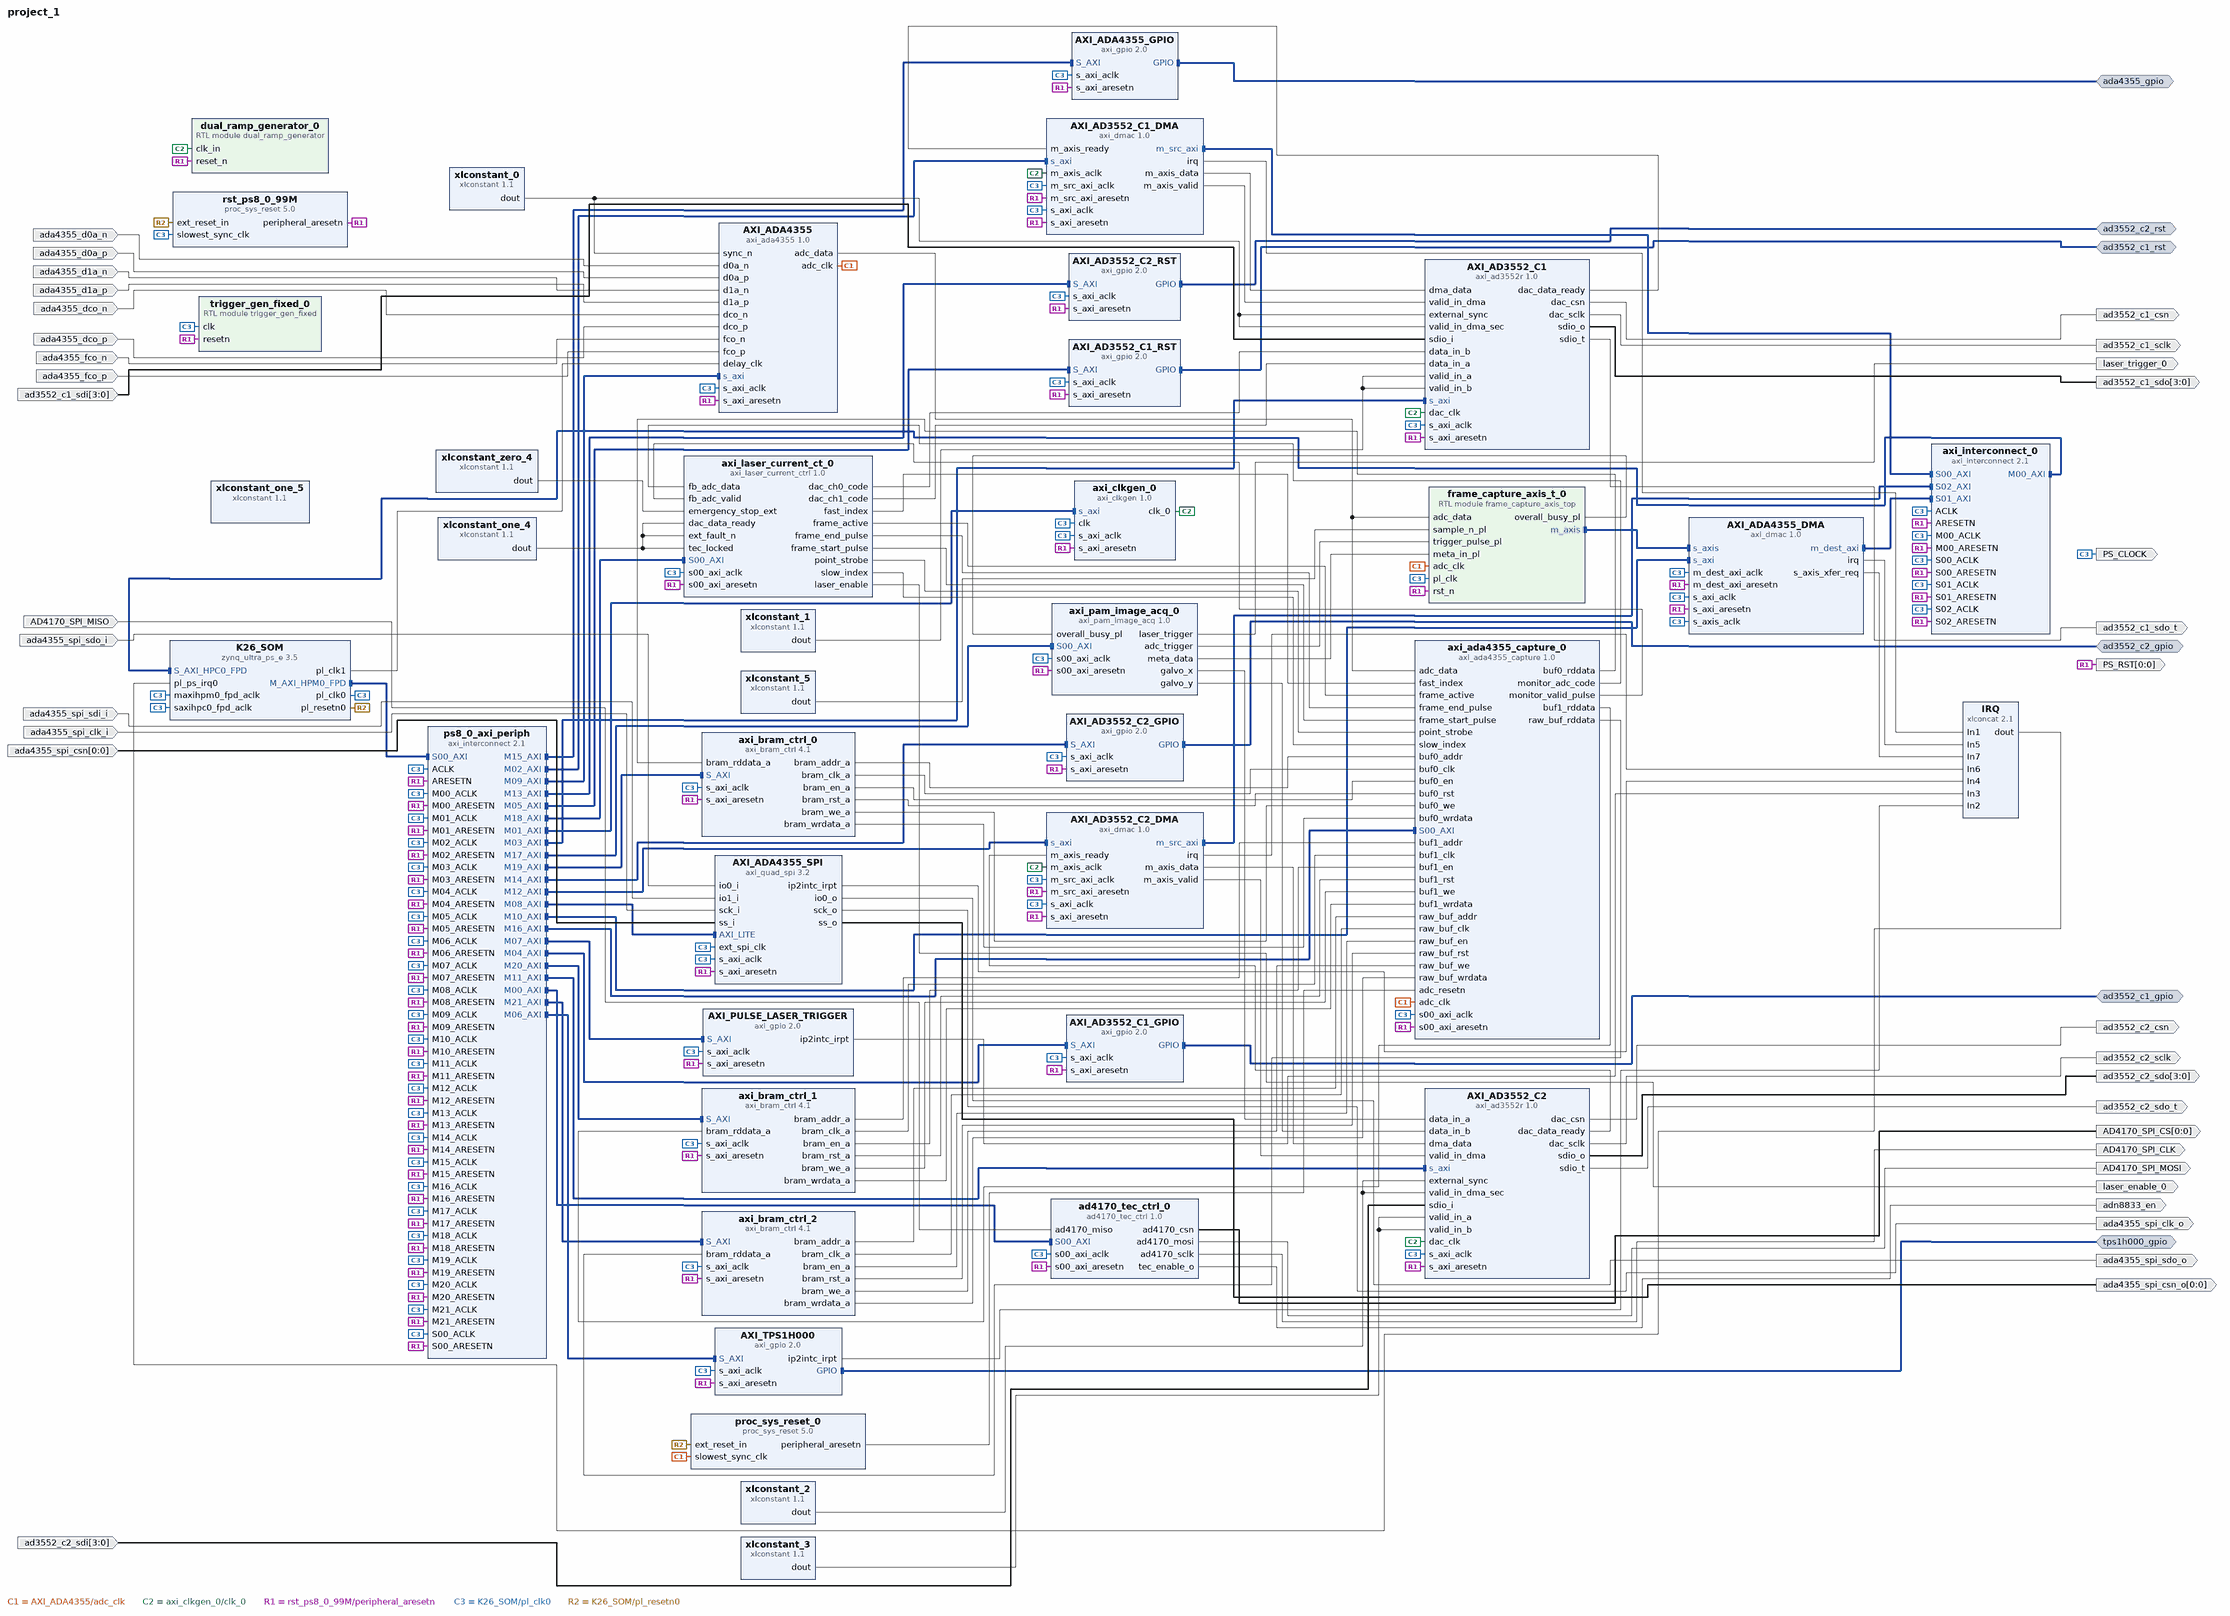
[diagram p0: block diagram of the top level]
# Vivado block design project_1, xck26-sfvc784-2LVI-i, Vivado 2023.2.2
create_bd_design project_1

create_bd_intf_port -mode Master -vlnv xilinx.com:interface:gpio_rtl:1.0 ad3552_c1_gpio
create_bd_intf_port -mode Master -vlnv xilinx.com:interface:gpio_rtl:1.0 ad3552_c1_rst
create_bd_intf_port -mode Master -vlnv xilinx.com:interface:gpio_rtl:1.0 tps1h000_gpio
create_bd_intf_port -mode Master -vlnv xilinx.com:interface:gpio_rtl:1.0 ad3552_c2_gpio
create_bd_intf_port -mode Master -vlnv xilinx.com:interface:gpio_rtl:1.0 ad3552_c2_rst
create_bd_intf_port -mode Master -vlnv xilinx.com:interface:gpio_rtl:1.0 ada4355_gpio
create_bd_port -dir O -from 0 -to 0 AD4170_SPI_CS
create_bd_port -dir I AD4170_SPI_MISO
create_bd_port -dir O AD4170_SPI_MOSI
create_bd_port -dir O AD4170_SPI_CLK
create_bd_port -dir O -type clk PS_CLOCK
create_bd_port -dir O -from 0 -to 0 -type rst PS_RST
create_bd_port -dir O ad3552_c1_sclk
create_bd_port -dir O ad3552_c1_csn
create_bd_port -dir O -from 3 -to 0 ad3552_c1_sdo
create_bd_port -dir O ad3552_c1_sdo_t
create_bd_port -dir I -from 3 -to 0 ad3552_c1_sdi
create_bd_port -dir I ada4355_spi_sdo_i
create_bd_port -dir O ada4355_spi_sdo_o
create_bd_port -dir I ada4355_spi_sdi_i
create_bd_port -dir I ada4355_spi_clk_i
create_bd_port -dir O ada4355_spi_clk_o
create_bd_port -dir I -from 0 -to 0 ada4355_spi_csn
create_bd_port -dir O -from 0 -to 0 ada4355_spi_csn_o
create_bd_port -dir I ada4355_dco_p
create_bd_port -dir I ada4355_dco_n
create_bd_port -dir I ada4355_d0a_p
create_bd_port -dir I ada4355_d0a_n
create_bd_port -dir I ada4355_d1a_p
create_bd_port -dir I ada4355_d1a_n
create_bd_port -dir I ada4355_fco_p
create_bd_port -dir I ada4355_fco_n
create_bd_port -dir O ad3552_c2_sclk
create_bd_port -dir O ad3552_c2_csn
create_bd_port -dir O -from 3 -to 0 ad3552_c2_sdo
create_bd_port -dir O ad3552_c2_sdo_t
create_bd_port -dir I -from 3 -to 0 ad3552_c2_sdi
create_bd_port -dir O laser_trigger_0
create_bd_port -dir O laser_enable_0
create_bd_port -dir O adn8833_en

create_bd_cell -type ip -vlnv xilinx.com:ip:zynq_ultra_ps_e:3.5 K26_SOM
set_property -dict [list \
  CONFIG.CAN0_BOARD_INTERFACE custom \
  CONFIG.CAN1_BOARD_INTERFACE custom \
  CONFIG.CSU_BOARD_INTERFACE custom \
  CONFIG.DP_BOARD_INTERFACE custom \
  CONFIG.GEM0_BOARD_INTERFACE custom \
  CONFIG.GEM1_BOARD_INTERFACE custom \
  CONFIG.GEM2_BOARD_INTERFACE custom \
  CONFIG.GEM3_BOARD_INTERFACE custom \
  CONFIG.GPIO_BOARD_INTERFACE custom \
  CONFIG.IIC0_BOARD_INTERFACE custom \
  CONFIG.IIC1_BOARD_INTERFACE custom \
  CONFIG.NAND_BOARD_INTERFACE custom \
  CONFIG.PCIE_BOARD_INTERFACE custom \
  CONFIG.PJTAG_BOARD_INTERFACE custom \
  CONFIG.PMU_BOARD_INTERFACE custom \
  CONFIG.PSU_BANK_0_IO_STANDARD LVCMOS18 \
  CONFIG.PSU_BANK_1_IO_STANDARD LVCMOS18 \
  CONFIG.PSU_BANK_2_IO_STANDARD LVCMOS18 \
  CONFIG.PSU_BANK_3_IO_STANDARD LVCMOS18 \
  CONFIG.PSU_USB3__DUAL_CLOCK_ENABLE 1 \
  CONFIG.PSU__CAN1__PERIPHERAL__ENABLE 0 \
  CONFIG.PSU__CRF_APB__ACPU_CTRL__FREQMHZ 1333.333 \
  CONFIG.PSU__CRF_APB__ACPU_CTRL__SRCSEL APLL \
  CONFIG.PSU__CRF_APB__APLL_CTRL__SRCSEL PSS_REF_CLK \
  CONFIG.PSU__CRF_APB__APLL_FRAC_CFG__ENABLED 1 \
  CONFIG.PSU__CRF_APB__DBG_FPD_CTRL__FREQMHZ 250 \
  CONFIG.PSU__CRF_APB__DBG_FPD_CTRL__SRCSEL IOPLL \
  CONFIG.PSU__CRF_APB__DBG_TRACE_CTRL__FREQMHZ 250 \
  CONFIG.PSU__CRF_APB__DBG_TRACE_CTRL__SRCSEL IOPLL \
  CONFIG.PSU__CRF_APB__DBG_TSTMP_CTRL__FREQMHZ 250 \
  CONFIG.PSU__CRF_APB__DBG_TSTMP_CTRL__SRCSEL IOPLL \
  CONFIG.PSU__CRF_APB__DDR_CTRL__FREQMHZ 1200 \
  CONFIG.PSU__CRF_APB__DDR_CTRL__SRCSEL DPLL \
  CONFIG.PSU__CRF_APB__DPDMA_REF_CTRL__FREQMHZ 600 \
  CONFIG.PSU__CRF_APB__DPDMA_REF_CTRL__SRCSEL APLL \
  CONFIG.PSU__CRF_APB__DPLL_CTRL__SRCSEL PSS_REF_CLK \
  CONFIG.PSU__CRF_APB__DP_AUDIO_REF_CTRL__SRCSEL RPLL \
  CONFIG.PSU__CRF_APB__DP_STC_REF_CTRL__SRCSEL RPLL \
  CONFIG.PSU__CRF_APB__DP_VIDEO_REF_CTRL__SRCSEL VPLL \
  CONFIG.PSU__CRF_APB__GDMA_REF_CTRL__FREQMHZ 600 \
  CONFIG.PSU__CRF_APB__GDMA_REF_CTRL__SRCSEL DPLL \
  CONFIG.PSU__CRF_APB__GPU_REF_CTRL__FREQMHZ 600 \
  CONFIG.PSU__CRF_APB__GPU_REF_CTRL__SRCSEL IOPLL \
  CONFIG.PSU__CRF_APB__TOPSW_LSBUS_CTRL__FREQMHZ 100 \
  CONFIG.PSU__CRF_APB__TOPSW_LSBUS_CTRL__SRCSEL IOPLL \
  CONFIG.PSU__CRF_APB__TOPSW_MAIN_CTRL__FREQMHZ 533.33 \
  CONFIG.PSU__CRF_APB__TOPSW_MAIN_CTRL__SRCSEL DPLL \
  CONFIG.PSU__CRF_APB__VPLL_CTRL__SRCSEL PSS_REF_CLK \
  CONFIG.PSU__CRL_APB__ADMA_REF_CTRL__FREQMHZ 500 \
  CONFIG.PSU__CRL_APB__ADMA_REF_CTRL__SRCSEL IOPLL \
  CONFIG.PSU__CRL_APB__CAN1_REF_CTRL__FREQMHZ 100 \
  CONFIG.PSU__CRL_APB__CAN1_REF_CTRL__SRCSEL IOPLL \
  CONFIG.PSU__CRL_APB__CPU_R5_CTRL__FREQMHZ 533.333 \
  CONFIG.PSU__CRL_APB__CPU_R5_CTRL__SRCSEL RPLL \
  CONFIG.PSU__CRL_APB__DBG_LPD_CTRL__FREQMHZ 250 \
  CONFIG.PSU__CRL_APB__DBG_LPD_CTRL__SRCSEL IOPLL \
  CONFIG.PSU__CRL_APB__GEM3_REF_CTRL__FREQMHZ 125 \
  CONFIG.PSU__CRL_APB__GEM3_REF_CTRL__SRCSEL IOPLL \
  CONFIG.PSU__CRL_APB__I2C0_REF_CTRL__FREQMHZ 100 \
  CONFIG.PSU__CRL_APB__I2C0_REF_CTRL__SRCSEL IOPLL \
  CONFIG.PSU__CRL_APB__I2C1_REF_CTRL__FREQMHZ 100 \
  CONFIG.PSU__CRL_APB__I2C1_REF_CTRL__SRCSEL IOPLL \
  CONFIG.PSU__CRL_APB__IOPLL_CTRL__SRCSEL PSS_REF_CLK \
  CONFIG.PSU__CRL_APB__IOU_SWITCH_CTRL__FREQMHZ 250 \
  CONFIG.PSU__CRL_APB__IOU_SWITCH_CTRL__SRCSEL IOPLL \
  CONFIG.PSU__CRL_APB__LPD_LSBUS_CTRL__FREQMHZ 100 \
  CONFIG.PSU__CRL_APB__LPD_LSBUS_CTRL__SRCSEL IOPLL \
  CONFIG.PSU__CRL_APB__LPD_SWITCH_CTRL__FREQMHZ 500 \
  CONFIG.PSU__CRL_APB__LPD_SWITCH_CTRL__SRCSEL IOPLL \
  CONFIG.PSU__CRL_APB__PCAP_CTRL__FREQMHZ 200 \
  CONFIG.PSU__CRL_APB__PCAP_CTRL__SRCSEL IOPLL \
  CONFIG.PSU__CRL_APB__PL0_REF_CTRL__FREQMHZ 100 \
  CONFIG.PSU__CRL_APB__PL0_REF_CTRL__SRCSEL IOPLL \
  CONFIG.PSU__CRL_APB__PL1_REF_CTRL__FREQMHZ 200 \
  CONFIG.PSU__CRL_APB__QSPI_REF_CTRL__FREQMHZ 125 \
  CONFIG.PSU__CRL_APB__QSPI_REF_CTRL__SRCSEL IOPLL \
  CONFIG.PSU__CRL_APB__RPLL_CTRL__SRCSEL PSS_REF_CLK \
  CONFIG.PSU__CRL_APB__SDIO0_REF_CTRL__SRCSEL IOPLL \
  CONFIG.PSU__CRL_APB__SDIO1_REF_CTRL__FREQMHZ 200 \
  CONFIG.PSU__CRL_APB__SDIO1_REF_CTRL__SRCSEL IOPLL \
  CONFIG.PSU__CRL_APB__SPI1_REF_CTRL__SRCSEL IOPLL \
  CONFIG.PSU__CRL_APB__TIMESTAMP_REF_CTRL__FREQMHZ 100 \
  CONFIG.PSU__CRL_APB__TIMESTAMP_REF_CTRL__SRCSEL IOPLL \
  CONFIG.PSU__CRL_APB__UART0_REF_CTRL__FREQMHZ 100 \
  CONFIG.PSU__CRL_APB__UART0_REF_CTRL__SRCSEL IOPLL \
  CONFIG.PSU__CRL_APB__UART1_REF_CTRL__FREQMHZ 100 \
  CONFIG.PSU__CRL_APB__UART1_REF_CTRL__SRCSEL IOPLL \
  CONFIG.PSU__CRL_APB__USB0_BUS_REF_CTRL__FREQMHZ 250 \
  CONFIG.PSU__CRL_APB__USB0_BUS_REF_CTRL__SRCSEL IOPLL \
  CONFIG.PSU__CRL_APB__USB3_DUAL_REF_CTRL__FREQMHZ 20 \
  CONFIG.PSU__CRL_APB__USB3_DUAL_REF_CTRL__SRCSEL IOPLL \
  CONFIG.PSU__CRL_APB__USB3__ENABLE 1 \
  CONFIG.PSU__CSUPMU__PERIPHERAL__VALID 1 \
  CONFIG.PSU__DDRC__BUS_WIDTH {64 Bit} \
  CONFIG.PSU__DDRC__COMPONENTS Components \
  CONFIG.PSU__DDRC__DEVICE_CAPACITY {8192 MBits} \
  CONFIG.PSU__DDRC__DRAM_WIDTH {16 Bits} \
  CONFIG.PSU__DDRC__ECC Disabled \
  CONFIG.PSU__DDRC__MEMORY_TYPE {DDR 4} \
  CONFIG.PSU__DDRC__SPEED_BIN DDR4_2400R \
  CONFIG.PSU__DDR_HIGH_ADDRESS_GUI_ENABLE 1 \
  CONFIG.PSU__DDR__INTERFACE__FREQMHZ 600.000 \
  CONFIG.PSU__DEVICE_TYPE EV \
  CONFIG.PSU__DISPLAYPORT__PERIPHERAL__ENABLE 0 \
  CONFIG.PSU__DLL__ISUSED 1 \
  CONFIG.PSU__ENET3__FIFO__ENABLE 0 \
  CONFIG.PSU__ENET3__GRP_MDIO__ENABLE 1 \
  CONFIG.PSU__ENET3__GRP_MDIO__IO {MIO 76 .. 77} \
  CONFIG.PSU__ENET3__PERIPHERAL__ENABLE 1 \
  CONFIG.PSU__ENET3__PERIPHERAL__IO {GT Lane3} \
  CONFIG.PSU__ENET3__PTP__ENABLE 0 \
  CONFIG.PSU__ENET3__TSU__ENABLE 0 \
  CONFIG.PSU__FPGA_PL0_ENABLE 1 \
  CONFIG.PSU__FPGA_PL1_ENABLE 1 \
  CONFIG.PSU__GEM3_COHERENCY 0 \
  CONFIG.PSU__GEM3_ROUTE_THROUGH_FPD 0 \
  CONFIG.PSU__GEM3__REF_CLK_FREQ 125 \
  CONFIG.PSU__GEM3__REF_CLK_SEL {Ref Clk3} \
  CONFIG.PSU__GEM__TSU__ENABLE 0 \
  CONFIG.PSU__GPIO0_MIO__IO {MIO 0 .. 25} \
  CONFIG.PSU__GPIO0_MIO__PERIPHERAL__ENABLE 1 \
  CONFIG.PSU__GPIO1_MIO__IO {MIO 26 .. 51} \
  CONFIG.PSU__GPIO1_MIO__PERIPHERAL__ENABLE 1 \
  CONFIG.PSU__GPIO2_MIO__IO {MIO 52 .. 77} \
  CONFIG.PSU__GPIO2_MIO__PERIPHERAL__ENABLE 1 \
  CONFIG.PSU__I2C0__PERIPHERAL__ENABLE 0 \
  CONFIG.PSU__I2C1__PERIPHERAL__ENABLE 1 \
  CONFIG.PSU__I2C1__PERIPHERAL__IO {MIO 24 .. 25} \
  CONFIG.PSU__IOU_SLCR__IOU_TTC_APB_CLK__TTC0_SEL APB \
  CONFIG.PSU__IOU_SLCR__IOU_TTC_APB_CLK__TTC1_SEL APB \
  CONFIG.PSU__IOU_SLCR__IOU_TTC_APB_CLK__TTC2_SEL APB \
  CONFIG.PSU__IOU_SLCR__IOU_TTC_APB_CLK__TTC3_SEL APB \
  CONFIG.PSU__MAXIGP0__DATA_WIDTH 128 \
  CONFIG.PSU__OVERRIDE_HPX_QOS 0 \
  CONFIG.PSU__OVERRIDE__BASIC_CLOCK 0 \
  CONFIG.PSU__PMU_COHERENCY 0 \
  CONFIG.PSU__PMU__AIBACK__ENABLE 0 \
  CONFIG.PSU__PMU__EMIO_GPI__ENABLE 0 \
  CONFIG.PSU__PMU__EMIO_GPO__ENABLE 0 \
  CONFIG.PSU__PMU__GPI0__ENABLE 1 \
  CONFIG.PSU__PMU__GPI0__IO {MIO 26} \
  CONFIG.PSU__PMU__GPI1__ENABLE 0 \
  CONFIG.PSU__PMU__GPI2__ENABLE 0 \
  CONFIG.PSU__PMU__GPI3__ENABLE 0 \
  CONFIG.PSU__PMU__GPI4__ENABLE 0 \
  CONFIG.PSU__PMU__GPI5__ENABLE 1 \
  CONFIG.PSU__PMU__GPI5__IO {MIO 31} \
  CONFIG.PSU__PMU__GPO0__ENABLE 0 \
  CONFIG.PSU__PMU__GPO1__ENABLE 0 \
  CONFIG.PSU__PMU__GPO2__ENABLE 0 \
  CONFIG.PSU__PMU__GPO3__ENABLE 1 \
  CONFIG.PSU__PMU__GPO3__IO {MIO 35} \
  CONFIG.PSU__PMU__GPO3__POLARITY low \
  CONFIG.PSU__PMU__GPO4__ENABLE 0 \
  CONFIG.PSU__PMU__GPO5__ENABLE 0 \
  CONFIG.PSU__PMU__PERIPHERAL__ENABLE 1 \
  CONFIG.PSU__PMU__PLERROR__ENABLE 0 \
  CONFIG.PSU__PRESET_APPLIED 1 \
  CONFIG.PSU__PSS_REF_CLK__FREQMHZ 33.333 \
  CONFIG.PSU__QSPI_COHERENCY 0 \
  CONFIG.PSU__QSPI_ROUTE_THROUGH_FPD 0 \
  CONFIG.PSU__QSPI__GRP_FBCLK__ENABLE 0 \
  CONFIG.PSU__QSPI__PERIPHERAL__DATA_MODE x4 \
  CONFIG.PSU__QSPI__PERIPHERAL__ENABLE 1 \
  CONFIG.PSU__QSPI__PERIPHERAL__IO {MIO 0 .. 5} \
  CONFIG.PSU__QSPI__PERIPHERAL__MODE Single \
  CONFIG.PSU__SATA__PERIPHERAL__ENABLE 0 \
  CONFIG.PSU__SD0__CLK_200_SDR_OTAP_DLY 0x3 \
  CONFIG.PSU__SD0__CLK_50_DDR_ITAP_DLY 0x12 \
  CONFIG.PSU__SD0__CLK_50_DDR_OTAP_DLY 0x6 \
  CONFIG.PSU__SD0__CLK_50_SDR_ITAP_DLY 0x15 \
  CONFIG.PSU__SD0__CLK_50_SDR_OTAP_DLY 0x6 \
  CONFIG.PSU__SD0__DATA_TRANSFER_MODE 8Bit \
  CONFIG.PSU__SD0__GRP_POW__ENABLE 1 \
  CONFIG.PSU__SD0__GRP_POW__IO {MIO 23} \
  CONFIG.PSU__SD0__PERIPHERAL__ENABLE 1 \
  CONFIG.PSU__SD0__PERIPHERAL__IO {MIO 13 .. 22} \
  CONFIG.PSU__SD0__RESET__ENABLE 1 \
  CONFIG.PSU__SD0__SLOT_TYPE eMMC \
  CONFIG.PSU__SD1__CLK_100_SDR_OTAP_DLY 0x0 \
  CONFIG.PSU__SD1__CLK_200_SDR_OTAP_DLY 0x0 \
  CONFIG.PSU__SD1__CLK_50_DDR_ITAP_DLY 0x0 \
  CONFIG.PSU__SD1__CLK_50_DDR_OTAP_DLY 0x0 \
  CONFIG.PSU__SD1__CLK_50_SDR_ITAP_DLY 0x15 \
  CONFIG.PSU__SD1__CLK_50_SDR_OTAP_DLY 0x5 \
  CONFIG.PSU__SD1__PERIPHERAL__ENABLE 0 \
  CONFIG.PSU__SPI1__GRP_SS0__IO {MIO 9} \
  CONFIG.PSU__SPI1__PERIPHERAL__ENABLE 1 \
  CONFIG.PSU__SPI1__PERIPHERAL__IO {MIO 6 .. 11} \
  CONFIG.PSU__SWDT0__CLOCK__ENABLE 0 \
  CONFIG.PSU__SWDT0__PERIPHERAL__ENABLE 1 \
  CONFIG.PSU__SWDT0__RESET__ENABLE 0 \
  CONFIG.PSU__SWDT1__CLOCK__ENABLE 0 \
  CONFIG.PSU__SWDT1__PERIPHERAL__ENABLE 1 \
  CONFIG.PSU__SWDT1__RESET__ENABLE 0 \
  CONFIG.PSU__TSU__BUFG_PORT_PAIR 0 \
  CONFIG.PSU__TTC0__CLOCK__ENABLE 0 \
  CONFIG.PSU__TTC0__PERIPHERAL__ENABLE 1 \
  CONFIG.PSU__TTC0__WAVEOUT__ENABLE 0 \
  CONFIG.PSU__TTC1__CLOCK__ENABLE 0 \
  CONFIG.PSU__TTC1__PERIPHERAL__ENABLE 1 \
  CONFIG.PSU__TTC1__WAVEOUT__ENABLE 0 \
  CONFIG.PSU__TTC2__CLOCK__ENABLE 0 \
  CONFIG.PSU__TTC2__PERIPHERAL__ENABLE 1 \
  CONFIG.PSU__TTC2__WAVEOUT__ENABLE 0 \
  CONFIG.PSU__TTC3__CLOCK__ENABLE 0 \
  CONFIG.PSU__TTC3__PERIPHERAL__ENABLE 1 \
  CONFIG.PSU__TTC3__WAVEOUT__ENABLE 0 \
  CONFIG.PSU__UART0__PERIPHERAL__ENABLE 0 \
  CONFIG.PSU__UART1__BAUD_RATE 115200 \
  CONFIG.PSU__UART1__MODEM__ENABLE 0 \
  CONFIG.PSU__UART1__PERIPHERAL__ENABLE 1 \
  CONFIG.PSU__UART1__PERIPHERAL__IO {MIO 36 .. 37} \
  CONFIG.PSU__USB0_COHERENCY 0 \
  CONFIG.PSU__USB0__PERIPHERAL__ENABLE 1 \
  CONFIG.PSU__USB0__PERIPHERAL__IO {MIO 52 .. 63} \
  CONFIG.PSU__USB0__REF_CLK_FREQ 26 \
  CONFIG.PSU__USB0__REF_CLK_SEL {Ref Clk2} \
  CONFIG.PSU__USB0__RESET__ENABLE 1 \
  CONFIG.PSU__USB0__RESET__IO {MIO 27} \
  CONFIG.PSU__USB2_0__EMIO__ENABLE 0 \
  CONFIG.PSU__USB3_0__EMIO__ENABLE 0 \
  CONFIG.PSU__USB3_0__PERIPHERAL__ENABLE 1 \
  CONFIG.PSU__USB3_0__PERIPHERAL__IO {GT Lane2} \
  CONFIG.PSU__USB__RESET__MODE {Separate MIO Pin} \
  CONFIG.PSU__USB__RESET__POLARITY {Active Low} \
  CONFIG.PSU__USE__IRQ0 1 \
  CONFIG.PSU__USE__M_AXI_GP0 1 \
  CONFIG.PSU__USE__M_AXI_GP1 0 \
  CONFIG.PSU__USE__M_AXI_GP2 0 \
  CONFIG.PSU__USE__S_AXI_GP0 1 \
  CONFIG.QSPI_BOARD_INTERFACE custom \
  CONFIG.SATA_BOARD_INTERFACE custom \
  CONFIG.SD0_BOARD_INTERFACE custom \
  CONFIG.SD1_BOARD_INTERFACE custom \
  CONFIG.SPI0_BOARD_INTERFACE custom \
  CONFIG.SPI1_BOARD_INTERFACE custom \
  CONFIG.SUBPRESET1 Custom \
  CONFIG.SUBPRESET2 Custom \
  CONFIG.SWDT0_BOARD_INTERFACE custom \
  CONFIG.SWDT1_BOARD_INTERFACE custom \
  CONFIG.TRACE_BOARD_INTERFACE custom \
  CONFIG.TTC0_BOARD_INTERFACE custom \
  CONFIG.TTC1_BOARD_INTERFACE custom \
  CONFIG.TTC2_BOARD_INTERFACE custom \
  CONFIG.TTC3_BOARD_INTERFACE custom \
  CONFIG.UART0_BOARD_INTERFACE custom \
  CONFIG.UART1_BOARD_INTERFACE custom \
  CONFIG.USB0_BOARD_INTERFACE custom \
  CONFIG.USB1_BOARD_INTERFACE custom \
] [get_bd_cells K26_SOM]
# 782 more settings of K26_SOM are not shown: defaults, MIO pin electricals, DDR timing, and values the tool derives
create_bd_cell -type ip -vlnv xilinx.com:ip:axi_interconnect:2.1 ps8_0_axi_periph
set_property -dict {CONFIG.NUM_MI 22} [get_bd_cells ps8_0_axi_periph]
create_bd_cell -type ip -vlnv xilinx.com:ip:proc_sys_reset:5.0 rst_ps8_0_99M
create_bd_cell -type ip -vlnv xilinx.com:ip:xlconcat:2.1 IRQ
set_property -dict {CONFIG.NUM_PORTS 8} [get_bd_cells IRQ]
create_bd_cell -type ip -vlnv analog.com:user:axi_dmac:1.0 AXI_AD3552_C1_DMA
set_property -dict [list \
  CONFIG.ALLOW_ASYM_MEM 1 \
  CONFIG.AXI_SLICE_DEST false \
  CONFIG.CYCLIC true \
  CONFIG.DMA_DATA_WIDTH_DEST 32 \
  CONFIG.DMA_DATA_WIDTH_SRC 32 \
  CONFIG.DMA_TYPE_DEST 1 \
  CONFIG.DMA_TYPE_SRC 0 \
] [get_bd_cells AXI_AD3552_C1_DMA]
create_bd_cell -type ip -vlnv analog.com:user:axi_ad3552r:1.0 AXI_AD3552_C1
create_bd_cell -type ip -vlnv analog.com:user:axi_clkgen:1.0 axi_clkgen_0
set_property -dict [list \
  CONFIG.CLK0_DIV 10 \
  CONFIG.CLKIN_PERIOD 10 \
  CONFIG.DEV_PACKAGE 15 \
  CONFIG.FPGA_FAMILY 4 \
  CONFIG.FPGA_TECHNOLOGY 3 \
  CONFIG.FPGA_VOLTAGE 720 \
  CONFIG.SPEED_GRADE 25 \
  CONFIG.VCO_DIV 1 \
  CONFIG.VCO_MUL 12 \
] [get_bd_cells axi_clkgen_0]
create_bd_cell -type ip -vlnv xilinx.com:ip:axi_interconnect:2.1 axi_interconnect_0
set_property -dict {CONFIG.NUM_MI 1 CONFIG.NUM_SI 3} [get_bd_cells axi_interconnect_0]
create_bd_cell -type ip -vlnv xilinx.com:ip:xlconstant:1.1 xlconstant_0
set_property -dict {CONFIG.CONST_VAL 0} [get_bd_cells xlconstant_0]
create_bd_cell -type ip -vlnv xilinx.com:ip:axi_gpio:2.0 AXI_AD3552_C1_GPIO
set_property -dict {CONFIG.C_GPIO_WIDTH 2} [get_bd_cells AXI_AD3552_C1_GPIO]
create_bd_cell -type ip -vlnv xilinx.com:ip:axi_gpio:2.0 AXI_AD3552_C1_RST
set_property -dict {CONFIG.C_ALL_OUTPUTS 1 CONFIG.C_GPIO_WIDTH 1} [get_bd_cells AXI_AD3552_C1_RST]
create_bd_cell -type ip -vlnv xilinx.com:ip:axi_gpio:2.0 AXI_TPS1H000
set_property -dict [list \
  CONFIG.C_GPIO_WIDTH 2 \
  CONFIG.C_INTERRUPT_PRESENT 1 \
  CONFIG.C_TRI_DEFAULT 0x00000000 \
] [get_bd_cells AXI_TPS1H000]
create_bd_cell -type ip -vlnv xilinx.com:ip:axi_gpio:2.0 AXI_PULSE_LASER_TRIGGER
set_property -dict {CONFIG.C_GPIO_WIDTH 1 CONFIG.C_INTERRUPT_PRESENT 1} [get_bd_cells AXI_PULSE_LASER_TRIGGER]
create_bd_cell -type ip -vlnv xilinx.com:ip:axi_quad_spi:3.2 AXI_ADA4355_SPI
set_property -dict {CONFIG.C_SCK_RATIO 8} [get_bd_cells AXI_ADA4355_SPI]
create_bd_cell -type ip -vlnv analog.com:user:axi_ada4355:1.0 AXI_ADA4355
set_property -dict {CONFIG.FPGA_TECHNOLOGY 3} [get_bd_cells AXI_ADA4355]
create_bd_cell -type ip -vlnv analog.com:user:axi_dmac:1.0 AXI_ADA4355_DMA
set_property -dict [list \
  CONFIG.ALLOW_ASYM_MEM 1 \
  CONFIG.AXI_SLICE_SRC true \
  CONFIG.DMA_DATA_WIDTH_SRC 64 \
  CONFIG.DMA_TYPE_SRC 1 \
] [get_bd_cells AXI_ADA4355_DMA]
create_bd_cell -type ip -vlnv analog.com:user:axi_ad3552r:1.0 AXI_AD3552_C2
create_bd_cell -type ip -vlnv analog.com:user:axi_dmac:1.0 AXI_AD3552_C2_DMA
set_property -dict [list \
  CONFIG.ALLOW_ASYM_MEM 1 \
  CONFIG.AXI_SLICE_DEST false \
  CONFIG.CYCLIC true \
  CONFIG.DMA_DATA_WIDTH_DEST 32 \
  CONFIG.DMA_DATA_WIDTH_SRC 32 \
  CONFIG.DMA_TYPE_DEST 1 \
  CONFIG.DMA_TYPE_SRC 0 \
] [get_bd_cells AXI_AD3552_C2_DMA]
create_bd_cell -type ip -vlnv xilinx.com:ip:xlconstant:1.1 xlconstant_2
set_property -dict {CONFIG.CONST_VAL 0} [get_bd_cells xlconstant_2]
create_bd_cell -type ip -vlnv xilinx.com:ip:axi_gpio:2.0 AXI_AD3552_C2_RST
set_property -dict {CONFIG.C_ALL_OUTPUTS 1 CONFIG.C_GPIO_WIDTH 1} [get_bd_cells AXI_AD3552_C2_RST]
create_bd_cell -type ip -vlnv xilinx.com:ip:axi_gpio:2.0 AXI_AD3552_C2_GPIO
set_property -dict {CONFIG.C_ALL_OUTPUTS 0 CONFIG.C_GPIO_WIDTH 2} [get_bd_cells AXI_AD3552_C2_GPIO]
create_bd_cell -type ip -vlnv xilinx.com:ip:axi_gpio:2.0 AXI_ADA4355_GPIO
set_property -dict {CONFIG.C_ALL_OUTPUTS 1 CONFIG.C_GPIO_WIDTH 3} [get_bd_cells AXI_ADA4355_GPIO]
create_bd_cell -type module -reference dual_ramp_generator dual_ramp_generator_0
create_bd_cell -type ip -vlnv xilinx.com:ip:xlconstant:1.1 xlconstant_3
create_bd_cell -type module -reference frame_capture_axis_top frame_capture_axis_t_0
create_bd_cell -type ip -vlnv xilinx.com:ip:xlconstant:1.1 xlconstant_5
set_property -dict {CONFIG.CONST_VAL 2000 CONFIG.CONST_WIDTH 16} [get_bd_cells xlconstant_5]
create_bd_cell -type module -reference trigger_gen_fixed trigger_gen_fixed_0
set_property -dict {CONFIG.PERIOD 100000000} [get_bd_cells trigger_gen_fixed_0]
create_bd_cell -type ip -vlnv user.org:user:axi_laser_current_ctrl:1.0 axi_laser_current_ct_0
create_bd_cell -type ip -vlnv xilinx.com:ip:xlconstant:1.1 xlconstant_1
set_property -dict {CONFIG.CONST_VAL 1} [get_bd_cells xlconstant_1]
create_bd_cell -type ip -vlnv xilinx.com:ip:xlconstant:1.1 xlconstant_zero_4
set_property -dict {CONFIG.CONST_VAL 0} [get_bd_cells xlconstant_zero_4]
create_bd_cell -type ip -vlnv xilinx.com:ip:xlconstant:1.1 xlconstant_one_4
set_property -dict {CONFIG.CONST_VAL 1} [get_bd_cells xlconstant_one_4]
create_bd_cell -type ip -vlnv xilinx.com:ip:xlconstant:1.1 xlconstant_one_5
set_property -dict {CONFIG.CONST_VAL 20000 CONFIG.CONST_WIDTH 16} [get_bd_cells xlconstant_one_5]
create_bd_cell -type ip -vlnv user.org:user:ad4170_tec_ctrl:1.0 ad4170_tec_ctrl_0
create_bd_cell -type ip -vlnv user.org:user:axi_ada4355_capture:1.0 axi_ada4355_capture_0
create_bd_cell -type ip -vlnv xilinx.com:ip:proc_sys_reset:5.0 proc_sys_reset_0
create_bd_cell -type ip -vlnv xilinx.com:ip:axi_bram_ctrl:4.1 axi_bram_ctrl_0
set_property -dict {CONFIG.DATA_WIDTH 32 CONFIG.SINGLE_PORT_BRAM 1} [get_bd_cells axi_bram_ctrl_0]
create_bd_cell -type ip -vlnv xilinx.com:ip:axi_bram_ctrl:4.1 axi_bram_ctrl_1
set_property -dict {CONFIG.SINGLE_PORT_BRAM 1} [get_bd_cells axi_bram_ctrl_1]
create_bd_cell -type ip -vlnv xilinx.com:ip:axi_bram_ctrl:4.1 axi_bram_ctrl_2
set_property -dict {CONFIG.SINGLE_PORT_BRAM 1} [get_bd_cells axi_bram_ctrl_2]
create_bd_cell -type ip -vlnv user.org:user:axi_pam_image_acq:1.0 axi_pam_image_acq_0

# ---- connections ----

connect_bd_intf_net [get_bd_intf_ports ada4355_gpio] [get_bd_intf_pins AXI_ADA4355_GPIO/GPIO]
connect_bd_intf_net -intf_net axi_dmac_0_m_src_axi [get_bd_intf_pins AXI_AD3552_C1_DMA/m_src_axi] [get_bd_intf_pins axi_interconnect_0/S00_AXI]
connect_bd_intf_net -intf_net axi_dmac_1_m_dest_axi [get_bd_intf_pins AXI_ADA4355_DMA/m_dest_axi] [get_bd_intf_pins axi_interconnect_0/S01_AXI]
connect_bd_intf_net -intf_net axi_dmac_2_m_src_axi [get_bd_intf_pins AXI_AD3552_C2_DMA/m_src_axi] [get_bd_intf_pins axi_interconnect_0/S02_AXI]
connect_bd_intf_net -intf_net axi_gpio_0_GPIO [get_bd_intf_ports ad3552_c1_gpio] [get_bd_intf_pins AXI_AD3552_C1_GPIO/GPIO]
connect_bd_intf_net -intf_net axi_gpio_1_GPIO [get_bd_intf_ports ad3552_c1_rst] [get_bd_intf_pins AXI_AD3552_C1_RST/GPIO]
connect_bd_intf_net -intf_net axi_gpio_2_GPIO [get_bd_intf_ports tps1h000_gpio] [get_bd_intf_pins AXI_TPS1H000/GPIO]
connect_bd_intf_net -intf_net axi_gpio_4_GPIO [get_bd_intf_ports ad3552_c2_rst] [get_bd_intf_pins AXI_AD3552_C2_RST/GPIO]
connect_bd_intf_net -intf_net axi_gpio_5_GPIO [get_bd_intf_ports ad3552_c2_gpio] [get_bd_intf_pins AXI_AD3552_C2_GPIO/GPIO]
connect_bd_intf_net [get_bd_intf_pins axi_interconnect_0/M00_AXI] [get_bd_intf_pins K26_SOM/S_AXI_HPC0_FPD]
connect_bd_intf_net [get_bd_intf_pins frame_capture_axis_t_0/m_axis] [get_bd_intf_pins AXI_ADA4355_DMA/s_axis]
connect_bd_intf_net [get_bd_intf_pins ps8_0_axi_periph/M00_AXI] [get_bd_intf_pins ad4170_tec_ctrl_0/S00_AXI]
connect_bd_intf_net [get_bd_intf_pins ps8_0_axi_periph/M01_AXI] [get_bd_intf_pins axi_clkgen_0/s_axi]
connect_bd_intf_net [get_bd_intf_pins ps8_0_axi_periph/M02_AXI] [get_bd_intf_pins AXI_AD3552_C1_DMA/s_axi]
connect_bd_intf_net [get_bd_intf_pins ps8_0_axi_periph/M03_AXI] [get_bd_intf_pins AXI_AD3552_C1/s_axi]
connect_bd_intf_net [get_bd_intf_pins ps8_0_axi_periph/M04_AXI] [get_bd_intf_pins AXI_AD3552_C1_GPIO/S_AXI]
connect_bd_intf_net [get_bd_intf_pins ps8_0_axi_periph/M05_AXI] [get_bd_intf_pins AXI_AD3552_C1_RST/S_AXI]
connect_bd_intf_net [get_bd_intf_pins ps8_0_axi_periph/M06_AXI] [get_bd_intf_pins AXI_TPS1H000/S_AXI]
connect_bd_intf_net [get_bd_intf_pins ps8_0_axi_periph/M07_AXI] [get_bd_intf_pins AXI_PULSE_LASER_TRIGGER/S_AXI]
connect_bd_intf_net [get_bd_intf_pins ps8_0_axi_periph/M08_AXI] [get_bd_intf_pins AXI_ADA4355_SPI/AXI_LITE]
connect_bd_intf_net [get_bd_intf_pins ps8_0_axi_periph/M09_AXI] [get_bd_intf_pins AXI_ADA4355/s_axi]
connect_bd_intf_net [get_bd_intf_pins ps8_0_axi_periph/M10_AXI] [get_bd_intf_pins AXI_ADA4355_DMA/s_axi]
connect_bd_intf_net [get_bd_intf_pins ps8_0_axi_periph/M11_AXI] [get_bd_intf_pins AXI_AD3552_C2/s_axi]
connect_bd_intf_net [get_bd_intf_pins ps8_0_axi_periph/M12_AXI] [get_bd_intf_pins AXI_AD3552_C2_DMA/s_axi]
connect_bd_intf_net [get_bd_intf_pins ps8_0_axi_periph/M13_AXI] [get_bd_intf_pins AXI_AD3552_C2_RST/S_AXI]
connect_bd_intf_net [get_bd_intf_pins ps8_0_axi_periph/M14_AXI] [get_bd_intf_pins AXI_AD3552_C2_GPIO/S_AXI]
connect_bd_intf_net [get_bd_intf_pins ps8_0_axi_periph/M15_AXI] [get_bd_intf_pins AXI_ADA4355_GPIO/S_AXI]
connect_bd_intf_net [get_bd_intf_pins ps8_0_axi_periph/M16_AXI] [get_bd_intf_pins axi_ada4355_capture_0/S00_AXI]
connect_bd_intf_net [get_bd_intf_pins ps8_0_axi_periph/M17_AXI] [get_bd_intf_pins axi_pam_image_acq_0/S00_AXI]
connect_bd_intf_net [get_bd_intf_pins ps8_0_axi_periph/M18_AXI] [get_bd_intf_pins axi_laser_current_ct_0/S00_AXI]
connect_bd_intf_net [get_bd_intf_pins ps8_0_axi_periph/M19_AXI] [get_bd_intf_pins axi_bram_ctrl_0/S_AXI]
connect_bd_intf_net [get_bd_intf_pins ps8_0_axi_periph/M20_AXI] [get_bd_intf_pins axi_bram_ctrl_1/S_AXI]
connect_bd_intf_net [get_bd_intf_pins ps8_0_axi_periph/M21_AXI] [get_bd_intf_pins axi_bram_ctrl_2/S_AXI]
connect_bd_intf_net -intf_net zynq_ultra_ps_e_0_M_AXI_HPM0_FPD [get_bd_intf_pins K26_SOM/M_AXI_HPM0_FPD] [get_bd_intf_pins ps8_0_axi_periph/S00_AXI]
connect_bd_net [get_bd_ports AD4170_SPI_MISO] [get_bd_pins ad4170_tec_ctrl_0/ad4170_miso]
connect_bd_net [get_bd_pins AXI_ADA4355_DMA/irq] [get_bd_pins IRQ/In5]
connect_bd_net [get_bd_pins AXI_ADA4355_DMA/s_axis_xfer_req] [get_bd_pins IRQ/In7]
connect_bd_net [get_bd_pins AXI_ADA4355/adc_clk] \
  [get_bd_pins frame_capture_axis_t_0/adc_clk] [get_bd_pins proc_sys_reset_0/slowest_sync_clk] \
  [get_bd_pins axi_ada4355_capture_0/adc_clk]
connect_bd_net [get_bd_pins AXI_ADA4355/adc_data] [get_bd_pins frame_capture_axis_t_0/adc_data] [get_bd_pins axi_ada4355_capture_0/adc_data]
connect_bd_net [get_bd_pins ad4170_tec_ctrl_0/ad4170_csn] [get_bd_ports AD4170_SPI_CS]
connect_bd_net [get_bd_pins ad4170_tec_ctrl_0/ad4170_mosi] [get_bd_ports AD4170_SPI_MOSI]
connect_bd_net [get_bd_pins ad4170_tec_ctrl_0/ad4170_sclk] [get_bd_ports AD4170_SPI_CLK]
connect_bd_net [get_bd_pins ad4170_tec_ctrl_0/tec_enable_o] [get_bd_ports adn8833_en]
connect_bd_net -net axi_ad3552r_0_dac_csn [get_bd_pins AXI_AD3552_C1/dac_csn] [get_bd_ports ad3552_c1_csn]
connect_bd_net -net axi_ad3552r_0_dac_data_ready [get_bd_pins AXI_AD3552_C1/dac_data_ready] [get_bd_pins AXI_AD3552_C1_DMA/m_axis_ready]
connect_bd_net -net axi_ad3552r_0_dac_sclk [get_bd_pins AXI_AD3552_C1/dac_sclk] [get_bd_ports ad3552_c1_sclk]
connect_bd_net -net axi_ad3552r_0_sdio_o [get_bd_pins AXI_AD3552_C1/sdio_o] [get_bd_ports ad3552_c1_sdo]
connect_bd_net -net axi_ad3552r_0_sdio_t [get_bd_pins AXI_AD3552_C1/sdio_t] [get_bd_ports ad3552_c1_sdo_t]
connect_bd_net -net axi_ad3552r_1_dac_csn [get_bd_pins AXI_AD3552_C2/dac_csn] [get_bd_ports ad3552_c2_csn]
connect_bd_net -net axi_ad3552r_1_dac_data_ready [get_bd_pins AXI_AD3552_C2/dac_data_ready] [get_bd_pins AXI_AD3552_C2_DMA/m_axis_ready]
connect_bd_net -net axi_ad3552r_1_dac_sclk [get_bd_pins AXI_AD3552_C2/dac_sclk] [get_bd_ports ad3552_c2_sclk]
connect_bd_net -net axi_ad3552r_1_sdio_o [get_bd_pins AXI_AD3552_C2/sdio_o] [get_bd_ports ad3552_c2_sdo]
connect_bd_net -net axi_ad3552r_1_sdio_t [get_bd_pins AXI_AD3552_C2/sdio_t] [get_bd_ports ad3552_c2_sdo_t]
connect_bd_net [get_bd_pins axi_ada4355_capture_0/buf0_rddata] [get_bd_pins axi_bram_ctrl_0/bram_rddata_a]
connect_bd_net [get_bd_pins axi_ada4355_capture_0/buf1_rddata] [get_bd_pins axi_bram_ctrl_1/bram_rddata_a]
connect_bd_net [get_bd_pins axi_ada4355_capture_0/monitor_adc_code] [get_bd_pins axi_laser_current_ct_0/fb_adc_data]
connect_bd_net [get_bd_pins axi_ada4355_capture_0/monitor_valid_pulse] [get_bd_pins axi_laser_current_ct_0/fb_adc_valid]
connect_bd_net [get_bd_pins axi_ada4355_capture_0/raw_buf_rddata] [get_bd_pins axi_bram_ctrl_2/bram_rddata_a]
connect_bd_net [get_bd_pins axi_bram_ctrl_0/bram_addr_a] [get_bd_pins axi_ada4355_capture_0/buf0_addr]
connect_bd_net [get_bd_pins axi_bram_ctrl_0/bram_clk_a] [get_bd_pins axi_ada4355_capture_0/buf0_clk]
connect_bd_net [get_bd_pins axi_bram_ctrl_0/bram_en_a] [get_bd_pins axi_ada4355_capture_0/buf0_en]
connect_bd_net [get_bd_pins axi_bram_ctrl_0/bram_rst_a] [get_bd_pins axi_ada4355_capture_0/buf0_rst]
connect_bd_net [get_bd_pins axi_bram_ctrl_0/bram_we_a] [get_bd_pins axi_ada4355_capture_0/buf0_we]
connect_bd_net [get_bd_pins axi_bram_ctrl_0/bram_wrdata_a] [get_bd_pins axi_ada4355_capture_0/buf0_wrdata]
connect_bd_net [get_bd_pins axi_bram_ctrl_1/bram_addr_a] [get_bd_pins axi_ada4355_capture_0/buf1_addr]
connect_bd_net [get_bd_pins axi_bram_ctrl_1/bram_clk_a] [get_bd_pins axi_ada4355_capture_0/buf1_clk]
connect_bd_net [get_bd_pins axi_bram_ctrl_1/bram_en_a] [get_bd_pins axi_ada4355_capture_0/buf1_en]
connect_bd_net [get_bd_pins axi_bram_ctrl_1/bram_rst_a] [get_bd_pins axi_ada4355_capture_0/buf1_rst]
connect_bd_net [get_bd_pins axi_bram_ctrl_1/bram_we_a] [get_bd_pins axi_ada4355_capture_0/buf1_we]
connect_bd_net [get_bd_pins axi_bram_ctrl_1/bram_wrdata_a] [get_bd_pins axi_ada4355_capture_0/buf1_wrdata]
connect_bd_net [get_bd_pins axi_bram_ctrl_2/bram_addr_a] [get_bd_pins axi_ada4355_capture_0/raw_buf_addr]
connect_bd_net [get_bd_pins axi_bram_ctrl_2/bram_clk_a] [get_bd_pins axi_ada4355_capture_0/raw_buf_clk]
connect_bd_net [get_bd_pins axi_bram_ctrl_2/bram_en_a] [get_bd_pins axi_ada4355_capture_0/raw_buf_en]
connect_bd_net [get_bd_pins axi_bram_ctrl_2/bram_rst_a] [get_bd_pins axi_ada4355_capture_0/raw_buf_rst]
connect_bd_net [get_bd_pins axi_bram_ctrl_2/bram_we_a] [get_bd_pins axi_ada4355_capture_0/raw_buf_we]
connect_bd_net [get_bd_pins axi_bram_ctrl_2/bram_wrdata_a] [get_bd_pins axi_ada4355_capture_0/raw_buf_wrdata]
connect_bd_net [get_bd_pins axi_clkgen_0/clk_0] \
  [get_bd_pins AXI_AD3552_C1/dac_clk] [get_bd_pins AXI_AD3552_C2/dac_clk] [get_bd_pins dual_ramp_generator_0/clk_in] \
  [get_bd_pins AXI_AD3552_C1_DMA/m_axis_aclk] [get_bd_pins AXI_AD3552_C2_DMA/m_axis_aclk]
connect_bd_net -net axi_dmac_0_irq [get_bd_pins AXI_AD3552_C1_DMA/irq] [get_bd_pins IRQ/In1]
connect_bd_net -net axi_dmac_0_m_axis_data [get_bd_pins AXI_AD3552_C1_DMA/m_axis_data] [get_bd_pins AXI_AD3552_C1/dma_data]
connect_bd_net -net axi_dmac_0_m_axis_valid [get_bd_pins AXI_AD3552_C1_DMA/m_axis_valid] [get_bd_pins AXI_AD3552_C1/valid_in_dma]
connect_bd_net -net axi_dmac_2_irq [get_bd_pins AXI_AD3552_C2_DMA/irq] [get_bd_pins IRQ/In6]
connect_bd_net -net axi_dmac_2_m_axis_data [get_bd_pins AXI_AD3552_C2_DMA/m_axis_data] [get_bd_pins AXI_AD3552_C2/dma_data]
connect_bd_net -net axi_dmac_2_m_axis_valid [get_bd_pins AXI_AD3552_C2_DMA/m_axis_valid] [get_bd_pins AXI_AD3552_C2/valid_in_dma]
connect_bd_net -net axi_gpio_2_ip2intc_irpt [get_bd_pins AXI_TPS1H000/ip2intc_irpt] [get_bd_pins IRQ/In2]
connect_bd_net -net axi_gpio_3_ip2intc_irpt [get_bd_pins AXI_PULSE_LASER_TRIGGER/ip2intc_irpt] [get_bd_pins IRQ/In3]
connect_bd_net [get_bd_pins axi_laser_current_ct_0/dac_ch0_code] [get_bd_pins AXI_AD3552_C1/data_in_b]
connect_bd_net [get_bd_pins axi_laser_current_ct_0/dac_ch1_code] [get_bd_pins AXI_AD3552_C1/data_in_a]
connect_bd_net [get_bd_pins axi_laser_current_ct_0/fast_index] [get_bd_pins axi_ada4355_capture_0/fast_index]
connect_bd_net [get_bd_pins axi_laser_current_ct_0/frame_active] [get_bd_pins axi_ada4355_capture_0/frame_active]
connect_bd_net [get_bd_pins axi_laser_current_ct_0/frame_end_pulse] [get_bd_pins axi_ada4355_capture_0/frame_end_pulse]
connect_bd_net [get_bd_pins axi_laser_current_ct_0/frame_start_pulse] [get_bd_pins axi_ada4355_capture_0/frame_start_pulse]
connect_bd_net [get_bd_pins axi_laser_current_ct_0/laser_enable] [get_bd_ports laser_enable_0]
connect_bd_net [get_bd_pins axi_laser_current_ct_0/point_strobe] [get_bd_pins axi_ada4355_capture_0/point_strobe]
connect_bd_net [get_bd_pins axi_laser_current_ct_0/slow_index] [get_bd_pins axi_ada4355_capture_0/slow_index]
connect_bd_net [get_bd_pins axi_pam_image_acq_0/adc_trigger] [get_bd_pins frame_capture_axis_t_0/trigger_pulse_pl]
connect_bd_net [get_bd_pins axi_pam_image_acq_0/galvo_x] [get_bd_pins AXI_AD3552_C2/data_in_a]
connect_bd_net [get_bd_pins axi_pam_image_acq_0/galvo_y] [get_bd_pins AXI_AD3552_C2/data_in_b]
connect_bd_net [get_bd_pins axi_pam_image_acq_0/laser_trigger] [get_bd_ports laser_trigger_0]
connect_bd_net [get_bd_pins axi_pam_image_acq_0/meta_data] [get_bd_pins frame_capture_axis_t_0/meta_in_pl]
connect_bd_net -net axi_quad_spi_1_io0_o [get_bd_pins AXI_ADA4355_SPI/io0_o] [get_bd_ports ada4355_spi_sdo_o]
connect_bd_net -net axi_quad_spi_1_ip2intc_irpt [get_bd_pins AXI_ADA4355_SPI/ip2intc_irpt] [get_bd_pins IRQ/In4]
connect_bd_net -net axi_quad_spi_1_sck_o [get_bd_pins AXI_ADA4355_SPI/sck_o] [get_bd_ports ada4355_spi_clk_o]
connect_bd_net -net axi_quad_spi_1_ss_o [get_bd_pins AXI_ADA4355_SPI/ss_o] [get_bd_ports ada4355_spi_csn_o]
connect_bd_net -net d0a_n_0_1 [get_bd_ports ada4355_d0a_n] [get_bd_pins AXI_ADA4355/d0a_n]
connect_bd_net -net d0a_p_0_1 [get_bd_ports ada4355_d0a_p] [get_bd_pins AXI_ADA4355/d0a_p]
connect_bd_net -net d1a_n_0_1 [get_bd_ports ada4355_d1a_n] [get_bd_pins AXI_ADA4355/d1a_n]
connect_bd_net -net d1a_p_0_1 [get_bd_ports ada4355_d1a_p] [get_bd_pins AXI_ADA4355/d1a_p]
connect_bd_net -net dac_spi_sdi_1 [get_bd_ports ad3552_c1_sdi] [get_bd_pins AXI_AD3552_C1/sdio_i]
connect_bd_net -net dco_n_0_1 [get_bd_ports ada4355_dco_n] [get_bd_pins AXI_ADA4355/dco_n]
connect_bd_net -net dco_p_0_1 [get_bd_ports ada4355_dco_p] [get_bd_pins AXI_ADA4355/dco_p]
connect_bd_net -net fco_n_0_1 [get_bd_ports ada4355_fco_n] [get_bd_pins AXI_ADA4355/fco_n]
connect_bd_net -net fco_p_0_1 [get_bd_ports ada4355_fco_p] [get_bd_pins AXI_ADA4355/fco_p]
connect_bd_net [get_bd_pins frame_capture_axis_t_0/overall_busy_pl] [get_bd_pins axi_pam_image_acq_0/overall_busy_pl]
connect_bd_net -net io0_i_0_1 [get_bd_ports ada4355_spi_sdo_i] [get_bd_pins AXI_ADA4355_SPI/io0_i]
connect_bd_net -net io1_i_0_1 [get_bd_ports ada4355_spi_sdi_i] [get_bd_pins AXI_ADA4355_SPI/io1_i]
connect_bd_net [get_bd_pins proc_sys_reset_0/peripheral_aresetn] [get_bd_pins axi_ada4355_capture_0/adc_resetn]
connect_bd_net [get_bd_pins rst_ps8_0_99M/peripheral_aresetn] \
  [get_bd_pins ps8_0_axi_periph/S00_ARESETN] [get_bd_pins ps8_0_axi_periph/M00_ARESETN] \
  [get_bd_pins ps8_0_axi_periph/ARESETN] [get_bd_ports PS_RST] [get_bd_pins ps8_0_axi_periph/M01_ARESETN] \
  [get_bd_pins ps8_0_axi_periph/M02_ARESETN] [get_bd_pins axi_interconnect_0/ARESETN] \
  [get_bd_pins axi_interconnect_0/M00_ARESETN] [get_bd_pins axi_interconnect_0/S00_ARESETN] \
  [get_bd_pins AXI_AD3552_C1/s_axi_aresetn] [get_bd_pins ps8_0_axi_periph/M03_ARESETN] \
  [get_bd_pins AXI_AD3552_C1_GPIO/s_axi_aresetn] [get_bd_pins ps8_0_axi_periph/M04_ARESETN] \
  [get_bd_pins AXI_AD3552_C1_RST/s_axi_aresetn] [get_bd_pins ps8_0_axi_periph/M05_ARESETN] \
  [get_bd_pins AXI_TPS1H000/s_axi_aresetn] [get_bd_pins ps8_0_axi_periph/M06_ARESETN] \
  [get_bd_pins AXI_PULSE_LASER_TRIGGER/s_axi_aresetn] [get_bd_pins ps8_0_axi_periph/M07_ARESETN] \
  [get_bd_pins ps8_0_axi_periph/M08_ARESETN] [get_bd_pins AXI_ADA4355_SPI/s_axi_aresetn] \
  [get_bd_pins ps8_0_axi_periph/M09_ARESETN] [get_bd_pins axi_interconnect_0/S01_ARESETN] \
  [get_bd_pins ps8_0_axi_periph/M10_ARESETN] [get_bd_pins AXI_ADA4355/s_axi_aresetn] \
  [get_bd_pins AXI_AD3552_C2/s_axi_aresetn] [get_bd_pins ps8_0_axi_periph/M11_ARESETN] \
  [get_bd_pins axi_interconnect_0/S02_ARESETN] [get_bd_pins ps8_0_axi_periph/M12_ARESETN] \
  [get_bd_pins AXI_AD3552_C2_RST/s_axi_aresetn] [get_bd_pins ps8_0_axi_periph/M13_ARESETN] \
  [get_bd_pins AXI_AD3552_C2_GPIO/s_axi_aresetn] [get_bd_pins ps8_0_axi_periph/M14_ARESETN] \
  [get_bd_pins AXI_ADA4355_GPIO/s_axi_aresetn] [get_bd_pins ps8_0_axi_periph/M15_ARESETN] \
  [get_bd_pins ps8_0_axi_periph/M16_ARESETN] [get_bd_pins frame_capture_axis_t_0/rst_n] \
  [get_bd_pins trigger_gen_fixed_0/resetn] [get_bd_pins ps8_0_axi_periph/M17_ARESETN] \
  [get_bd_pins dual_ramp_generator_0/reset_n] [get_bd_pins ps8_0_axi_periph/M18_ARESETN] \
  [get_bd_pins axi_bram_ctrl_0/s_axi_aresetn] [get_bd_pins ps8_0_axi_periph/M19_ARESETN] \
  [get_bd_pins axi_bram_ctrl_1/s_axi_aresetn] [get_bd_pins ps8_0_axi_periph/M20_ARESETN] \
  [get_bd_pins ad4170_tec_ctrl_0/s00_axi_aresetn] [get_bd_pins axi_laser_current_ct_0/s00_axi_aresetn] \
  [get_bd_pins axi_bram_ctrl_2/s_axi_aresetn] [get_bd_pins ps8_0_axi_periph/M21_ARESETN] \
  [get_bd_pins axi_ada4355_capture_0/s00_axi_aresetn] [get_bd_pins axi_pam_image_acq_0/s00_axi_aresetn] \
  [get_bd_pins axi_clkgen_0/s_axi_aresetn] [get_bd_pins AXI_AD3552_C1_DMA/s_axi_aresetn] \
  [get_bd_pins AXI_AD3552_C1_DMA/m_src_axi_aresetn] [get_bd_pins AXI_AD3552_C2_DMA/s_axi_aresetn] \
  [get_bd_pins AXI_AD3552_C2_DMA/m_src_axi_aresetn] [get_bd_pins AXI_ADA4355_DMA/s_axi_aresetn] \
  [get_bd_pins AXI_ADA4355_DMA/m_dest_axi_aresetn]
connect_bd_net -net sck_i_0_1 [get_bd_ports ada4355_spi_clk_i] [get_bd_pins AXI_ADA4355_SPI/sck_i]
connect_bd_net -net sdio_i_0_1 [get_bd_ports ad3552_c2_sdi] [get_bd_pins AXI_AD3552_C2/sdio_i]
connect_bd_net -net ss_i_0_1 [get_bd_ports ada4355_spi_csn] [get_bd_pins AXI_ADA4355_SPI/ss_i]
connect_bd_net -net xlconcat_0_dout [get_bd_pins IRQ/dout] [get_bd_pins K26_SOM/pl_ps_irq0]
connect_bd_net [get_bd_pins xlconstant_0/dout] \
  [get_bd_pins AXI_AD3552_C1/valid_in_dma_sec] [get_bd_pins AXI_AD3552_C1/external_sync] [get_bd_pins AXI_ADA4355/sync_n]
connect_bd_net [get_bd_pins xlconstant_1/dout] [get_bd_pins AXI_AD3552_C1/valid_in_a] [get_bd_pins AXI_AD3552_C1/valid_in_b]
connect_bd_net [get_bd_pins xlconstant_2/dout] [get_bd_pins AXI_AD3552_C2/external_sync] [get_bd_pins AXI_AD3552_C2/valid_in_dma_sec]
connect_bd_net [get_bd_pins xlconstant_3/dout] [get_bd_pins AXI_AD3552_C2/valid_in_b] [get_bd_pins AXI_AD3552_C2/valid_in_a]
connect_bd_net -net xlconstant_4_dout [get_bd_pins xlconstant_zero_4/dout] [get_bd_pins axi_laser_current_ct_0/emergency_stop_ext]
connect_bd_net [get_bd_pins xlconstant_5/dout] [get_bd_pins frame_capture_axis_t_0/sample_n_pl]
connect_bd_net [get_bd_pins xlconstant_one_4/dout] \
  [get_bd_pins axi_laser_current_ct_0/tec_locked] [get_bd_pins axi_laser_current_ct_0/ext_fault_n] \
  [get_bd_pins axi_laser_current_ct_0/dac_data_ready]
connect_bd_net -net zynq_ultra_ps_e_0_pl_clk0 [get_bd_pins K26_SOM/pl_clk0] \
  [get_bd_pins K26_SOM/maxihpm0_fpd_aclk] [get_bd_pins ps8_0_axi_periph/S00_ACLK] \
  [get_bd_pins rst_ps8_0_99M/slowest_sync_clk] [get_bd_pins ps8_0_axi_periph/M00_ACLK] [get_bd_pins ps8_0_axi_periph/ACLK] \
  [get_bd_ports PS_CLOCK] [get_bd_pins ps8_0_axi_periph/M01_ACLK] [get_bd_pins ps8_0_axi_periph/M02_ACLK] \
  [get_bd_pins axi_interconnect_0/ACLK] [get_bd_pins axi_interconnect_0/M00_ACLK] [get_bd_pins K26_SOM/saxihpc0_fpd_aclk] \
  [get_bd_pins axi_interconnect_0/S00_ACLK] [get_bd_pins AXI_AD3552_C1/s_axi_aclk] [get_bd_pins ps8_0_axi_periph/M03_ACLK] \
  [get_bd_pins AXI_AD3552_C1_GPIO/s_axi_aclk] [get_bd_pins ps8_0_axi_periph/M04_ACLK] \
  [get_bd_pins AXI_AD3552_C1_RST/s_axi_aclk] [get_bd_pins ps8_0_axi_periph/M05_ACLK] [get_bd_pins AXI_TPS1H000/s_axi_aclk] \
  [get_bd_pins ps8_0_axi_periph/M06_ACLK] [get_bd_pins AXI_PULSE_LASER_TRIGGER/s_axi_aclk] \
  [get_bd_pins ps8_0_axi_periph/M07_ACLK] [get_bd_pins ps8_0_axi_periph/M08_ACLK] [get_bd_pins AXI_ADA4355_SPI/s_axi_aclk] \
  [get_bd_pins AXI_ADA4355_SPI/ext_spi_clk] [get_bd_pins ps8_0_axi_periph/M09_ACLK] [get_bd_pins axi_interconnect_0/S01_ACLK] \
  [get_bd_pins ps8_0_axi_periph/M10_ACLK] [get_bd_pins AXI_ADA4355/s_axi_aclk] [get_bd_pins AXI_AD3552_C2/s_axi_aclk] \
  [get_bd_pins ps8_0_axi_periph/M11_ACLK] [get_bd_pins axi_interconnect_0/S02_ACLK] [get_bd_pins ps8_0_axi_periph/M12_ACLK] \
  [get_bd_pins AXI_AD3552_C2_RST/s_axi_aclk] [get_bd_pins ps8_0_axi_periph/M13_ACLK] \
  [get_bd_pins AXI_AD3552_C2_GPIO/s_axi_aclk] [get_bd_pins ps8_0_axi_periph/M14_ACLK] \
  [get_bd_pins AXI_ADA4355_GPIO/s_axi_aclk] [get_bd_pins ps8_0_axi_periph/M15_ACLK] [get_bd_pins ps8_0_axi_periph/M16_ACLK] \
  [get_bd_pins frame_capture_axis_t_0/pl_clk] [get_bd_pins trigger_gen_fixed_0/clk] [get_bd_pins ps8_0_axi_periph/M17_ACLK] \
  [get_bd_pins ps8_0_axi_periph/M18_ACLK] [get_bd_pins axi_bram_ctrl_0/s_axi_aclk] [get_bd_pins ps8_0_axi_periph/M19_ACLK] \
  [get_bd_pins axi_bram_ctrl_1/s_axi_aclk] [get_bd_pins ps8_0_axi_periph/M20_ACLK] \
  [get_bd_pins ad4170_tec_ctrl_0/s00_axi_aclk] [get_bd_pins axi_laser_current_ct_0/s00_axi_aclk] \
  [get_bd_pins axi_bram_ctrl_2/s_axi_aclk] [get_bd_pins ps8_0_axi_periph/M21_ACLK] \
  [get_bd_pins axi_ada4355_capture_0/s00_axi_aclk] [get_bd_pins axi_pam_image_acq_0/s00_axi_aclk] \
  [get_bd_pins axi_clkgen_0/clk] [get_bd_pins axi_clkgen_0/s_axi_aclk] [get_bd_pins AXI_AD3552_C1_DMA/s_axi_aclk] \
  [get_bd_pins AXI_AD3552_C1_DMA/m_src_axi_aclk] [get_bd_pins AXI_AD3552_C2_DMA/s_axi_aclk] \
  [get_bd_pins AXI_AD3552_C2_DMA/m_src_axi_aclk] [get_bd_pins AXI_ADA4355_DMA/s_axi_aclk] \
  [get_bd_pins AXI_ADA4355_DMA/m_dest_axi_aclk] [get_bd_pins AXI_ADA4355_DMA/s_axis_aclk]
connect_bd_net -net zynq_ultra_ps_e_0_pl_clk1 [get_bd_pins K26_SOM/pl_clk1] [get_bd_pins AXI_ADA4355/delay_clk]
connect_bd_net -net zynq_ultra_ps_e_0_pl_resetn0 [get_bd_pins K26_SOM/pl_resetn0] \
  [get_bd_pins rst_ps8_0_99M/ext_reset_in] [get_bd_pins proc_sys_reset_0/ext_reset_in]

# ---- address map ----
assign_bd_address -offset 0x00000000 -range 2G -target_address_space [get_bd_addr_spaces AXI_AD3552_C1_DMA/m_src_axi] [get_bd_addr_segs K26_SOM/SAXIGP0/HPC0_DDR_LOW]
assign_bd_address -offset 0xC0000000 -range 512M -target_address_space [get_bd_addr_spaces AXI_AD3552_C1_DMA/m_src_axi] [get_bd_addr_segs K26_SOM/SAXIGP0/HPC0_QSPI]
assign_bd_address -offset 0xFF000000 -range 16M -target_address_space [get_bd_addr_spaces AXI_AD3552_C1_DMA/m_src_axi] [get_bd_addr_segs K26_SOM/SAXIGP0/HPC0_LPS_OCM]
exclude_bd_addr_seg -offset 0x800000000 -range 4G -target_address_space [get_bd_addr_spaces AXI_AD3552_C1_DMA/m_src_axi] [get_bd_addr_segs K26_SOM/SAXIGP0/HPC0_DDR_HIGH]
assign_bd_address -offset 0x00000000 -range 2G -target_address_space [get_bd_addr_spaces AXI_AD3552_C2_DMA/m_src_axi] [get_bd_addr_segs K26_SOM/SAXIGP0/HPC0_DDR_LOW]
assign_bd_address -offset 0xC0000000 -range 512M -target_address_space [get_bd_addr_spaces AXI_AD3552_C2_DMA/m_src_axi] [get_bd_addr_segs K26_SOM/SAXIGP0/HPC0_QSPI]
assign_bd_address -offset 0xFF000000 -range 16M -target_address_space [get_bd_addr_spaces AXI_AD3552_C2_DMA/m_src_axi] [get_bd_addr_segs K26_SOM/SAXIGP0/HPC0_LPS_OCM]
exclude_bd_addr_seg -offset 0x00000000 -range 1 -target_address_space [get_bd_addr_spaces AXI_AD3552_C2_DMA/m_src_axi] [get_bd_addr_segs K26_SOM/SAXIGP0/HPC0_DDR_HIGH]
assign_bd_address -offset 0x00000000 -range 2G -target_address_space [get_bd_addr_spaces AXI_ADA4355_DMA/m_dest_axi] [get_bd_addr_segs K26_SOM/SAXIGP0/HPC0_DDR_LOW]
assign_bd_address -offset 0xC0000000 -range 512M -target_address_space [get_bd_addr_spaces AXI_ADA4355_DMA/m_dest_axi] [get_bd_addr_segs K26_SOM/SAXIGP0/HPC0_QSPI]
assign_bd_address -offset 0xFF000000 -range 16M -target_address_space [get_bd_addr_spaces AXI_ADA4355_DMA/m_dest_axi] [get_bd_addr_segs K26_SOM/SAXIGP0/HPC0_LPS_OCM]
exclude_bd_addr_seg -offset 0x00000000 -range 1 -target_address_space [get_bd_addr_spaces AXI_ADA4355_DMA/m_dest_axi] [get_bd_addr_segs K26_SOM/SAXIGP0/HPC0_DDR_HIGH]
assign_bd_address -offset 0x00A0000000 -range 64K -target_address_space [get_bd_addr_spaces K26_SOM/Data] [get_bd_addr_segs ad4170_tec_ctrl_0/S00_AXI/S00_AXI_reg]
assign_bd_address -offset 0x00A0010000 -range 64K -target_address_space [get_bd_addr_spaces K26_SOM/Data] [get_bd_addr_segs axi_clkgen_0/s_axi/axi_lite]
assign_bd_address -offset 0x00A0020000 -range 64K -target_address_space [get_bd_addr_spaces K26_SOM/Data] [get_bd_addr_segs AXI_AD3552_C1_DMA/s_axi/axi_lite]
assign_bd_address -offset 0x00A0030000 -range 64K -target_address_space [get_bd_addr_spaces K26_SOM/Data] [get_bd_addr_segs AXI_AD3552_C1/s_axi/axi_lite]
assign_bd_address -offset 0x00A0040000 -range 64K -target_address_space [get_bd_addr_spaces K26_SOM/Data] [get_bd_addr_segs AXI_AD3552_C1_GPIO/S_AXI/Reg]
assign_bd_address -offset 0x00A0050000 -range 64K -target_address_space [get_bd_addr_spaces K26_SOM/Data] [get_bd_addr_segs AXI_AD3552_C1_RST/S_AXI/Reg]
assign_bd_address -offset 0x00A0060000 -range 64K -target_address_space [get_bd_addr_spaces K26_SOM/Data] [get_bd_addr_segs AXI_TPS1H000/S_AXI/Reg]
assign_bd_address -offset 0x00A0070000 -range 64K -target_address_space [get_bd_addr_spaces K26_SOM/Data] [get_bd_addr_segs AXI_PULSE_LASER_TRIGGER/S_AXI/Reg]
assign_bd_address -offset 0x00A0080000 -range 64K -target_address_space [get_bd_addr_spaces K26_SOM/Data] [get_bd_addr_segs AXI_ADA4355_SPI/AXI_LITE/Reg]
assign_bd_address -offset 0x00A0090000 -range 64K -target_address_space [get_bd_addr_spaces K26_SOM/Data] [get_bd_addr_segs AXI_ADA4355/s_axi/axi_lite]
assign_bd_address -offset 0x00A00A0000 -range 64K -target_address_space [get_bd_addr_spaces K26_SOM/Data] [get_bd_addr_segs AXI_ADA4355_DMA/s_axi/axi_lite]
assign_bd_address -offset 0x00A00B0000 -range 64K -target_address_space [get_bd_addr_spaces K26_SOM/Data] [get_bd_addr_segs AXI_AD3552_C2/s_axi/axi_lite]
assign_bd_address -offset 0x00A00C0000 -range 64K -target_address_space [get_bd_addr_spaces K26_SOM/Data] [get_bd_addr_segs AXI_AD3552_C2_DMA/s_axi/axi_lite]
assign_bd_address -offset 0x00A00D0000 -range 64K -target_address_space [get_bd_addr_spaces K26_SOM/Data] [get_bd_addr_segs AXI_AD3552_C2_RST/S_AXI/Reg]
assign_bd_address -offset 0x00A00E0000 -range 64K -target_address_space [get_bd_addr_spaces K26_SOM/Data] [get_bd_addr_segs AXI_AD3552_C2_GPIO/S_AXI/Reg]
assign_bd_address -offset 0x00A00F0000 -range 64K -target_address_space [get_bd_addr_spaces K26_SOM/Data] [get_bd_addr_segs AXI_ADA4355_GPIO/S_AXI/Reg]
assign_bd_address -offset 0x00A0100000 -range 64K -target_address_space [get_bd_addr_spaces K26_SOM/Data] [get_bd_addr_segs axi_ada4355_capture_0/S00_AXI/S00_AXI_reg]
assign_bd_address -offset 0x00A0110000 -range 64K -target_address_space [get_bd_addr_spaces K26_SOM/Data] [get_bd_addr_segs axi_pam_image_acq_0/S00_AXI/reg0]
assign_bd_address -offset 0x00A0120000 -range 64K -target_address_space [get_bd_addr_spaces K26_SOM/Data] [get_bd_addr_segs axi_laser_current_ct_0/S00_AXI/S00_AXI_reg]
assign_bd_address -offset 0x00A01C0000 -range 64K -target_address_space [get_bd_addr_spaces K26_SOM/Data] [get_bd_addr_segs axi_bram_ctrl_0/S_AXI/Mem0]
assign_bd_address -offset 0x00A01D0000 -range 64K -target_address_space [get_bd_addr_spaces K26_SOM/Data] [get_bd_addr_segs axi_bram_ctrl_1/S_AXI/Mem0]
assign_bd_address -offset 0x00A0200000 -range 1M -target_address_space [get_bd_addr_spaces K26_SOM/Data] [get_bd_addr_segs axi_bram_ctrl_2/S_AXI/Mem0]

validate_bd_design
save_bd_design
